# EAGLE design final manual (EAGLE 8.0.1)
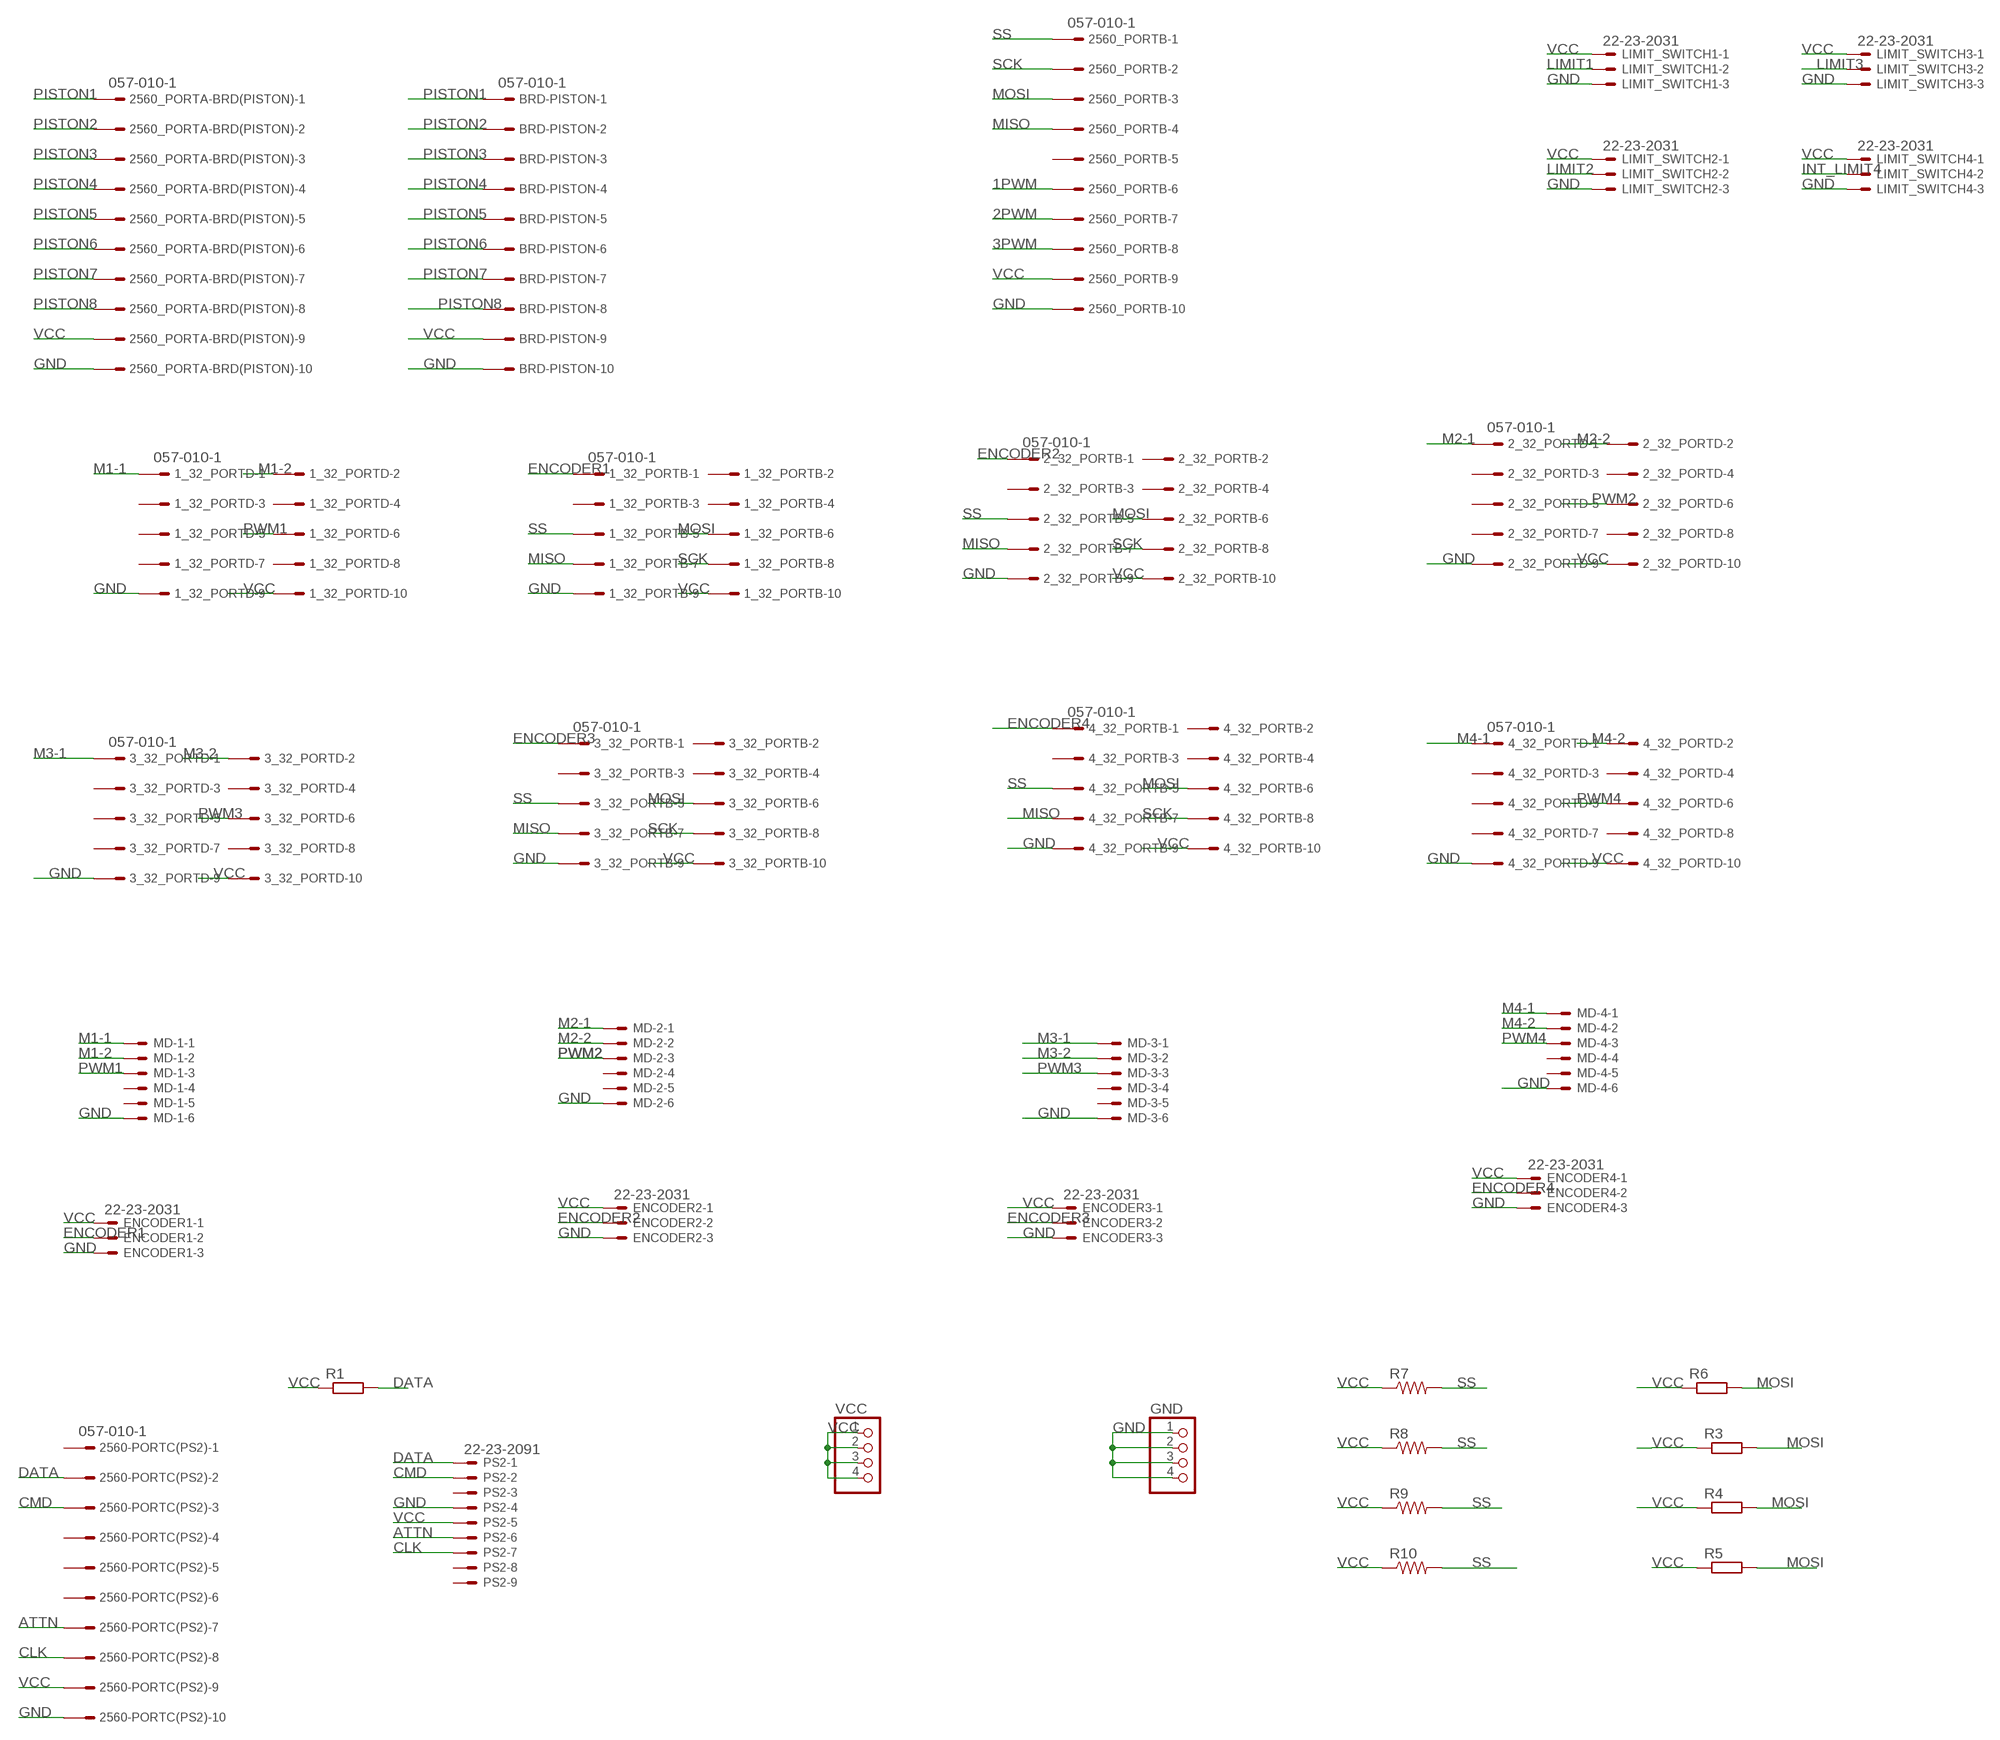
[diagram p0: schematic, sheet 1, part 1 of 2]
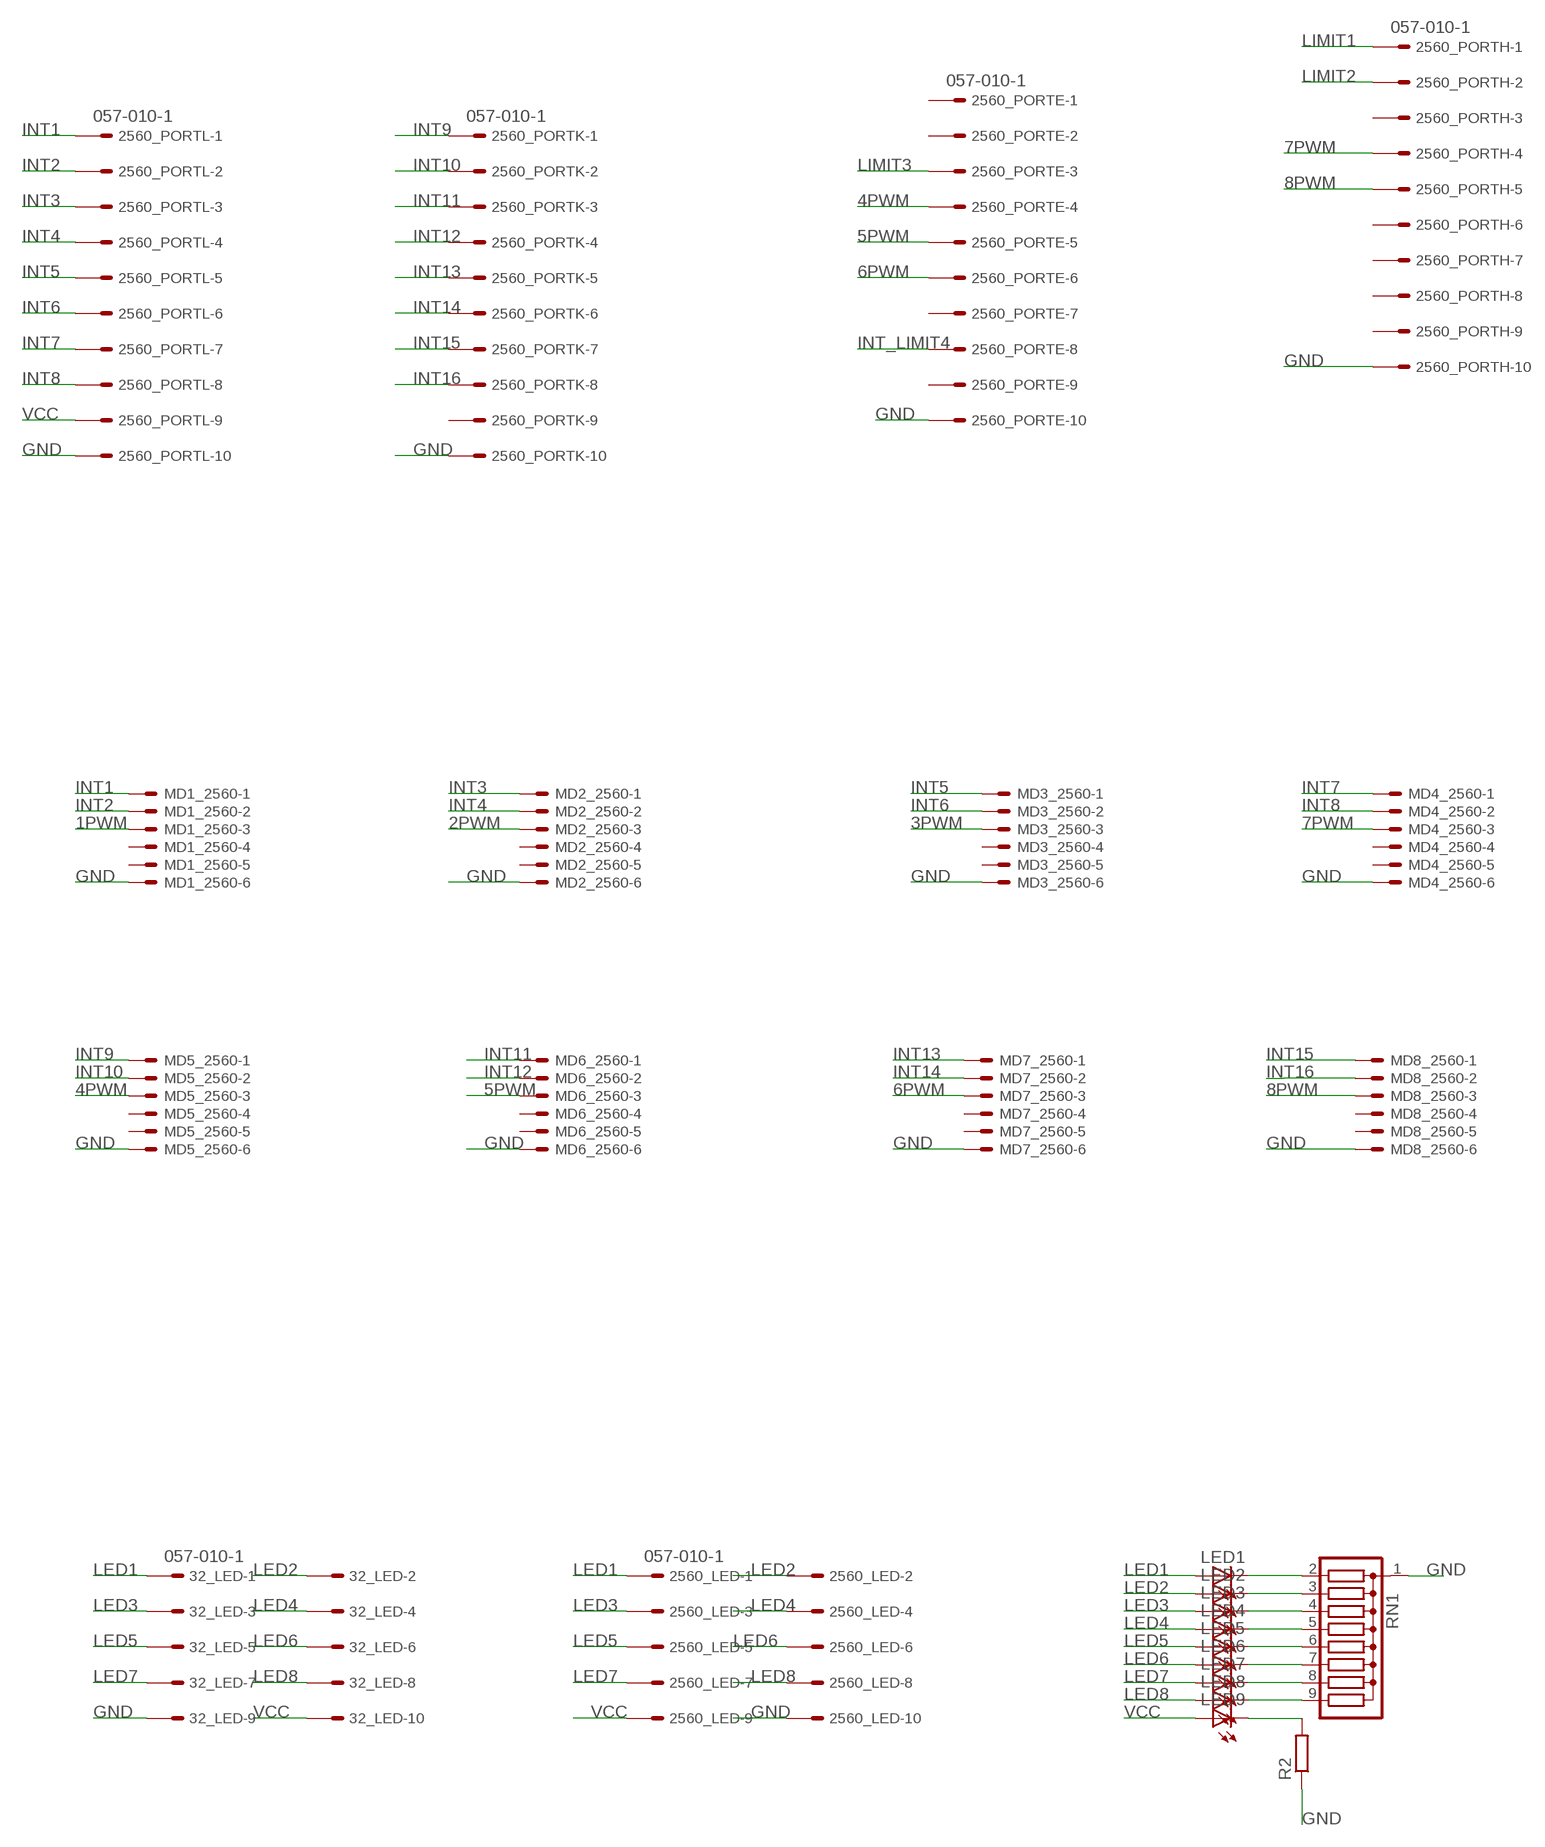
[diagram p1: schematic, sheet 1, part 2 of 2]

## Parts
1_32_PORTB  057-010-1  [057-010-1]
1_32_PORTD  057-010-1  [057-010-1]
2_32_PORTB  057-010-1  [057-010-1]
2_32_PORTD  057-010-1  [057-010-1]
3_32_PORTB  057-010-1  [057-010-1]
3_32_PORTD  057-010-1  [057-010-1]
4_32_PORTB  057-010-1  [057-010-1]
4_32_PORTD  057-010-1  [057-010-1]
32_LED  057-010-1  [057-010-1]
2560-PORTC(PS2)  057-010-1  [057-010-1]
2560_LED  057-010-1  [057-010-1]
2560_PORTA-BRD(PISTON)  057-010-1  [057-010-1]
2560_PORTB  057-010-1  [057-010-1]
2560_PORTE  057-010-1  [057-010-1]
2560_PORTH  057-010-1  [057-010-1]
2560_PORTK  057-010-1  [057-010-1]
2560_PORTL  057-010-1  [057-010-1]
BRD-PISTON  057-010-1  [057-010-1]
ENCODER1  22-23-2031  [22-23-2031]
ENCODER2  22-23-2031  [22-23-2031]
ENCODER3  22-23-2031  [22-23-2031]
ENCODER4  22-23-2031  [22-23-2031]
GND  PINHD-1X4  [1X04]
LED1  LED3MM  [LED3MM]
LED2  LED3MM  [LED3MM]
LED3  LED3MM  [LED3MM]
LED4  LED3MM  [LED3MM]
LED5  LED3MM  [LED3MM]
LED6  LED3MM  [LED3MM]
LED7  LED3MM  [LED3MM]
LED8  LED3MM  [LED3MM]
LED9  LED3MM  [LED3MM]
LIMIT_SWITCH1  22-23-2031  [22-23-2031]
LIMIT_SWITCH2  22-23-2031  [22-23-2031]
LIMIT_SWITCH3  22-23-2031  [22-23-2031]
LIMIT_SWITCH4  22-23-2031  [22-23-2031]
MD1_2560  22-23-2061  [22-23-2061]
MD2_2560  22-23-2061  [22-23-2061]
MD3_2560  22-23-2061  [22-23-2061]
MD4_2560  22-23-2061  [22-23-2061]
MD5_2560  22-23-2061  [22-23-2061]
MD6_2560  22-23-2061  [22-23-2061]
MD7_2560  22-23-2061  [22-23-2061]
MD8_2560  22-23-2061  [22-23-2061]
MD-1  22-23-2061  [22-23-2061]
MD-2  22-23-2061  [22-23-2061]
MD-3  22-23-2061  [22-23-2061]
MD-4  22-23-2061  [22-23-2061]
PS2  22-23-2091  [22-23-2091]
R1  R-EU_0204/7  [0204/7]
R2  R-EU_0204/7  [0204/7]
R3  R-EU_0204/7  [0204/7]
R4  R-EU_0204/7  [0204/7]
R5  R-EU_0204/7  [0204/7]
R6  R-EU_0204/7  [0204/7]
R7  R-US_0204/7  [0204/7]
R8  R-US_0204/7  [0204/7]
R9  R-US_0204/7  [0204/7]
R10  R-US_0204/7  [0204/7]
RN1  G08R  [SIL9]
VCC  PINHD-1X4  [1X04]

## Nets
1PWM: 2560_PORTB.6 MD1_2560.3
2PWM: 2560_PORTB.7 MD2_2560.3
3PWM: 2560_PORTB.8 MD3_2560.3
4PWM: 2560_PORTE.4 MD5_2560.3
5PWM: 2560_PORTE.5 MD6_2560.3
6PWM: 2560_PORTE.6 MD7_2560.3
7PWM: 2560_PORTH.4 MD4_2560.3
8PWM: 2560_PORTH.5 MD8_2560.3
ATTN: 2560-PORTC(PS2).7 PS2.6
CLK: 2560-PORTC(PS2).8 PS2.7
CMD: 2560-PORTC(PS2).3 PS2.2
DATA: 2560-PORTC(PS2).2 PS2.1 R1.2
ENCODER1: 1_32_PORTB.1 ENCODER1.2
ENCODER2: 2_32_PORTB.1 ENCODER2.2
ENCODER3: 3_32_PORTB.1 ENCODER3.2
ENCODER4: 4_32_PORTB.1 ENCODER4.2
GND: 1_32_PORTB.9 1_32_PORTD.9 2_32_PORTB.9 2_32_PORTD.9 3_32_PORTB.9 3_32_PORTD.9 4_32_PORTB.9 4_32_PORTD.9 32_LED.9 2560-PORTC(PS2).10 2560_LED.10 2560_PORTA-BRD(PISTON).10 2560_PORTB.10 2560_PORTE.10 2560_PORTH.10 2560_PORTK.10 2560_PORTL.10 BRD-PISTON.10 ENCODER1.3 ENCODER2.3 ENCODER3.3 ENCODER4.3 GND.1 GND.2 GND.3 GND.4 LIMIT_SWITCH1.3 LIMIT_SWITCH2.3 LIMIT_SWITCH3.3 LIMIT_SWITCH4.3 MD1_2560.6 MD2_2560.6 MD3_2560.6 MD4_2560.6 MD5_2560.6 MD6_2560.6 MD7_2560.6 MD8_2560.6 MD-1.6 MD-2.6 MD-3.6 MD-4.6 PS2.4 R2.1 RN1.1
INT1: 2560_PORTL.1 MD1_2560.1
INT2: 2560_PORTL.2 MD1_2560.2
INT3: 2560_PORTL.3 MD2_2560.1
INT4: 2560_PORTL.4 MD2_2560.2
INT5: 2560_PORTL.5 MD3_2560.1
INT6: 2560_PORTL.6 MD3_2560.2
INT7: 2560_PORTL.7 MD4_2560.1
INT8: 2560_PORTL.8 MD4_2560.2
INT9: 2560_PORTK.1 MD5_2560.1
INT10: 2560_PORTK.2 MD5_2560.2
INT11: 2560_PORTK.3 MD6_2560.1
INT12: 2560_PORTK.4 MD6_2560.2
INT13: 2560_PORTK.5 MD7_2560.1
INT14: 2560_PORTK.6 MD7_2560.2
INT15: 2560_PORTK.7 MD8_2560.1
INT16: 2560_PORTK.8 MD8_2560.2
INT_LIMIT4: 2560_PORTE.8 LIMIT_SWITCH4.2
LED1: 32_LED.1 2560_LED.1 LED1.A
LED2: 32_LED.2 2560_LED.2 LED2.A
LED3: 32_LED.3 2560_LED.3 LED3.A
LED4: 32_LED.4 2560_LED.4 LED4.A
LED5: 32_LED.5 2560_LED.5 LED5.A
LED6: 32_LED.6 2560_LED.6 LED6.A
LED7: 32_LED.7 2560_LED.7 LED7.A
LED8: 32_LED.8 2560_LED.8 LED8.A
LIMIT1: 2560_PORTH.1 LIMIT_SWITCH1.2
LIMIT2: 2560_PORTH.2 LIMIT_SWITCH2.2
LIMIT3: 2560_PORTE.3 LIMIT_SWITCH3.2
M1-1: 1_32_PORTD.1 MD-1.1
M1-2: 1_32_PORTD.2 MD-1.2
M2-1: 2_32_PORTD.1 MD-2.1
M2-2: 2_32_PORTD.2 MD-2.2
M3-1: 3_32_PORTD.1 MD-3.1
M3-2: 3_32_PORTD.2 MD-3.2
M4-1: 4_32_PORTD.1 MD-4.1
M4-2: 4_32_PORTD.2 MD-4.2
MISO: 1_32_PORTB.7 2_32_PORTB.7 3_32_PORTB.7 4_32_PORTB.7 2560_PORTB.4
MOSI: 1_32_PORTB.6 2_32_PORTB.6 3_32_PORTB.6 4_32_PORTB.6 2560_PORTB.3 R3.2 R4.2 R5.2 R6.2
N$1: LED1.K(C) RN1.2
N$2: LED2.K(C) RN1.3
N$3: LED3.K(C) RN1.4
N$4: LED4.K(C) RN1.5
N$5: LED5.K(C) RN1.6
N$6: LED6.K(C) RN1.7
N$7: LED7.K(C) RN1.8
N$8: LED8.K(C) RN1.9
N$10: LED9.K(C) R2.2
PISTON1: 2560_PORTA-BRD(PISTON).1 BRD-PISTON.1
PISTON2: 2560_PORTA-BRD(PISTON).2 BRD-PISTON.2
PISTON3: 2560_PORTA-BRD(PISTON).3 BRD-PISTON.3
PISTON4: 2560_PORTA-BRD(PISTON).4 BRD-PISTON.4
PISTON5: 2560_PORTA-BRD(PISTON).5 BRD-PISTON.5
PISTON6: 2560_PORTA-BRD(PISTON).6 BRD-PISTON.6
PISTON7: 2560_PORTA-BRD(PISTON).7 BRD-PISTON.7
PISTON8: 2560_PORTA-BRD(PISTON).8 BRD-PISTON.8
PWM1: 1_32_PORTD.6 MD-1.3
PWM2: 2_32_PORTD.6 MD-2.3
PWM3: 3_32_PORTD.6 MD-3.3
PWM4: 4_32_PORTD.6 MD-4.3
SCK: 1_32_PORTB.8 2_32_PORTB.8 3_32_PORTB.8 4_32_PORTB.8 2560_PORTB.2
SS: 1_32_PORTB.5 2_32_PORTB.5 3_32_PORTB.5 4_32_PORTB.5 2560_PORTB.1 R7.2 R8.2 R9.2 R10.2
VCC: 1_32_PORTB.10 1_32_PORTD.10 2_32_PORTB.10 2_32_PORTD.10 3_32_PORTB.10 3_32_PORTD.10 4_32_PORTB.10 4_32_PORTD.10 32_LED.10 2560-PORTC(PS2).9 2560_LED.9 2560_PORTA-BRD(PISTON).9 2560_PORTB.9 2560_PORTL.9 BRD-PISTON.9 ENCODER1.1 ENCODER2.1 ENCODER3.1 ENCODER4.1 LED9.A LIMIT_SWITCH1.1 LIMIT_SWITCH2.1 LIMIT_SWITCH3.1 LIMIT_SWITCH4.1 PS2.5 R1.1 R3.1 R4.1 R5.1 R6.1 R7.1 R8.1 R9.1 R10.1 VCC.1 VCC.2 VCC.3 VCC.4
Unconnected: 1_32_PORTB.2 1_32_PORTB.3 1_32_PORTB.4 1_32_PORTD.3 1_32_PORTD.4 1_32_PORTD.5 1_32_PORTD.7 1_32_PORTD.8 2_32_PORTB.2 2_32_PORTB.3 2_32_PORTB.4 2_32_PORTD.3 2_32_PORTD.4 2_32_PORTD.5 2_32_PORTD.7 2_32_PORTD.8 3_32_PORTB.2 3_32_PORTB.3 3_32_PORTB.4 3_32_PORTD.3 3_32_PORTD.4 3_32_PORTD.5 3_32_PORTD.7 3_32_PORTD.8 4_32_PORTB.2 4_32_PORTB.3 4_32_PORTB.4 4_32_PORTD.3 4_32_PORTD.4 4_32_PORTD.5 4_32_PORTD.7 4_32_PORTD.8 2560-PORTC(PS2).1 2560-PORTC(PS2).4 2560-PORTC(PS2).5 2560-PORTC(PS2).6 2560_PORTB.5 2560_PORTE.1 2560_PORTE.2 2560_PORTE.7 2560_PORTE.9 2560_PORTH.3 2560_PORTH.6 2560_PORTH.7 2560_PORTH.8 2560_PORTH.9 2560_PORTK.9 MD1_2560.4 MD1_2560.5 MD2_2560.4 MD2_2560.5 MD3_2560.4 MD3_2560.5 MD4_2560.4 MD4_2560.5 MD5_2560.4 MD5_2560.5 MD6_2560.4 MD6_2560.5 MD7_2560.4 MD7_2560.5 MD8_2560.4 MD8_2560.5 MD-1.4 MD-1.5 MD-2.4 MD-2.5 MD-3.4 MD-3.5 MD-4.4 MD-4.5 PS2.3 PS2.8 PS2.9

## Library data of the parts
1_32_PORTB 1_32_PORTD 2_32_PORTB 2_32_PORTD 3_32_PORTB 3_32_PORTD 4_32_PORTB 4_32_PORTD 32_LED 2560-PORTC(PS2) 2560_LED 2560_PORTA-BRD(PISTON) 2560_PORTB 2560_PORTE 2560_PORTH 2560_PORTK 2560_PORTL BRD-PISTON = con-panduit:057-010-: CONNECTOR 10-pin series 057 contact pc board low profile headers; OC_FARNELL: unknown; OC_NEWARK: unknown
ENCODER1-ENCODER4 LIMIT_SWITCH1-LIMIT_SWITCH4 = con-molex:22-23-2031: .100" (2.54mm) Center Header - 3 Pin; MF: MOLEX; MPN: 22-23-2031; OC_FARNELL: 1462950; OC_NEWARK: 30C0862
GND VCC = pinhead:PINHD-1X4: PIN HEADER
LED1-LED9 = led:LED: LED OSRAM: - CHIPLED LG R971, LG N971, LY N971, LG Q971, LY Q971, LO R971, LY R971 LH N974, LH R974 LS Q976, LO Q976, LY Q976 LO Q996 - Hyper CHIPLED LW Q18S LB Q993, LB Q99A, LB R99A - SideLED LS A670, LO A670, LY A670, LG A670, LP A670 LB A673, LV A673, LT A673, LW A673 LH A674 LY A675 LS A676, LA A676, LO A676, LY A676, LW A676 LS A679, LY A679, LG A679 - Hyper Micro SIDELED® LS Y876, LA Y876, LO Y876, LY Y876 LT Y87S - SmartLED LW L88C, LW L88S LB L89C, LB L89S, LG L890 LS L89K, LO L89K, LY L89K LS L896, LA L896, LO L896, LY L896 - TOPLED LS T670, LO T670, LY T670, LG T670, LP T670 LSG T670, LSP T670, LSY T670, LOP T670, LYG T670 LG T671, LOG T671, LSG T671 LB T673, LV T673, LT T673, LW T673 LH T674 LS T676, LA T676, LO T676, LY T676, LB T676, LH T676, LSB T676, LW T676 LB T67C, LV T67C, LT T67C, LS T67K, LO T67K, LY T67K, LW E67C LS E67B, LA E67B, LO E67B, LY E67B, LB E67C, LV E67C, LT E67C LW T67C LS T679, LY T679, LG T679 LS T770, LO T770, LY T770, LG T770, LP T770 LB T773, LV T773, LT T773, LW T773 LH T774 LS E675, LA E675, LY E675, LS T675 LS T776, LA T776, LO T776, LY T776, LB T776 LHGB T686 LT T68C, LB T68C - Hyper Mini TOPLED® LB M676 - Mini TOPLED Santana® LG M470 LS M47K, LO M47K, LY M47K Source: http://www.osram.convergy.de LUXEON: - LUMILED® LXK2-PW12-R00, LXK2-PW12-S00, LXK2-PW14-U00, LXK2-PW14-V00 LXK2-PM12-R00, LXK2-PM12-S00, LXK2-PM14-U00 LXK2-PE12-Q00, LXK2-PE12-R00, LXK2-PE12-S00, LXK2-PE14-T00, LXK2-PE14-U00 LXK2-PB12-K00, LXK2-PB12-L00, LXK2-PB12-M00, LXK2-PB14-N00, LXK2-PB14-P00, LXK2-PB14-Q00 LXK2-PR12-L00, LXK2-PR12-M00, LXK2-PR14-Q00, LXK2-PR14-R00 LXK2-PD12-Q00, LXK2-PD12-R00, LXK2-PD12-S00 LXK2-PH12-R00, LXK2-PH12-S00 LXK2-PL12-P00, LXK2-PL12-Q00, LXK2-PL12-R00 Source: www.luxeon.com KINGBRIGHT: KA-3528ASYC Source: www.kingbright.com
MD1_2560 MD2_2560 MD3_2560 MD4_2560 MD5_2560 MD6_2560 MD7_2560 MD8_2560 MD-1-MD-4 = con-molex:22-23-2061: .100" (2.54mm) Center Header - 6 Pin; MF: MOLEX; MPN: 22-23-2061; OC_FARNELL: 1462922; OC_NEWARK: 27C1933
PS2 = con-molex:22-23-2091: .100" (2.54mm) Center Header - 9 Pin; MF: MOLEX; MPN: 22-23-2091; OC_FARNELL: 1756827; OC_NEWARK: 56H0450
R1-R6 = rcl:R-EU_: RESISTOR, European symbol
R7-R10 = rcl:R-US_: RESISTOR, American symbol
RN1 = resistor-sil:G08R: SIL RESISTOR; OC_FARNELL: unknown; OC_NEWARK: unknown

## Board
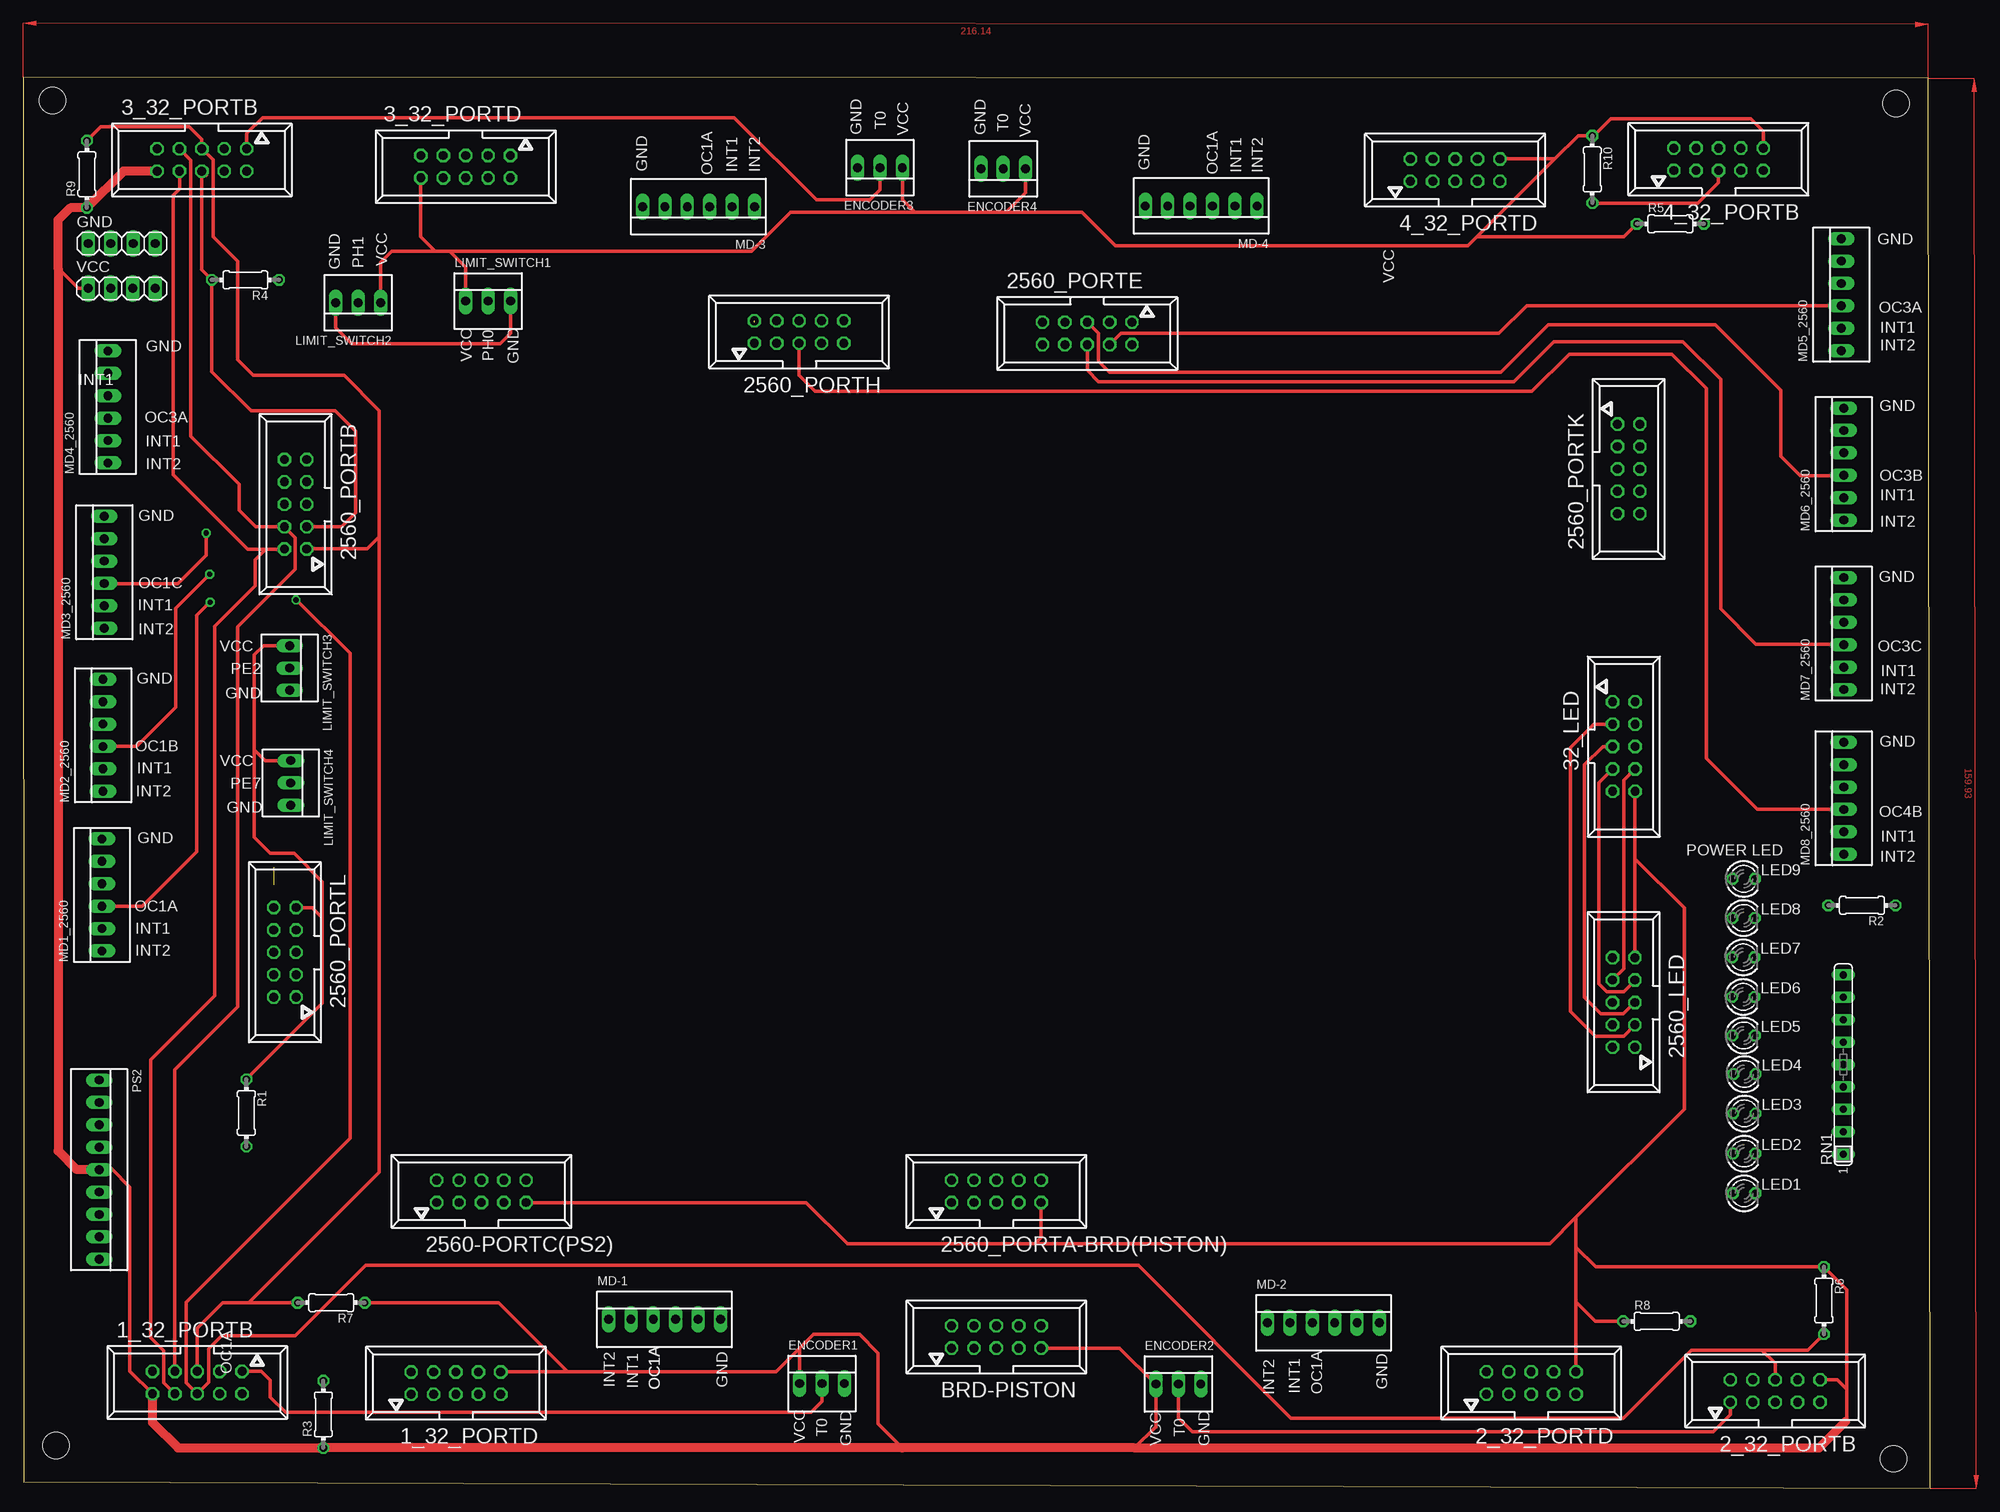
[diagram p2: board, top side]
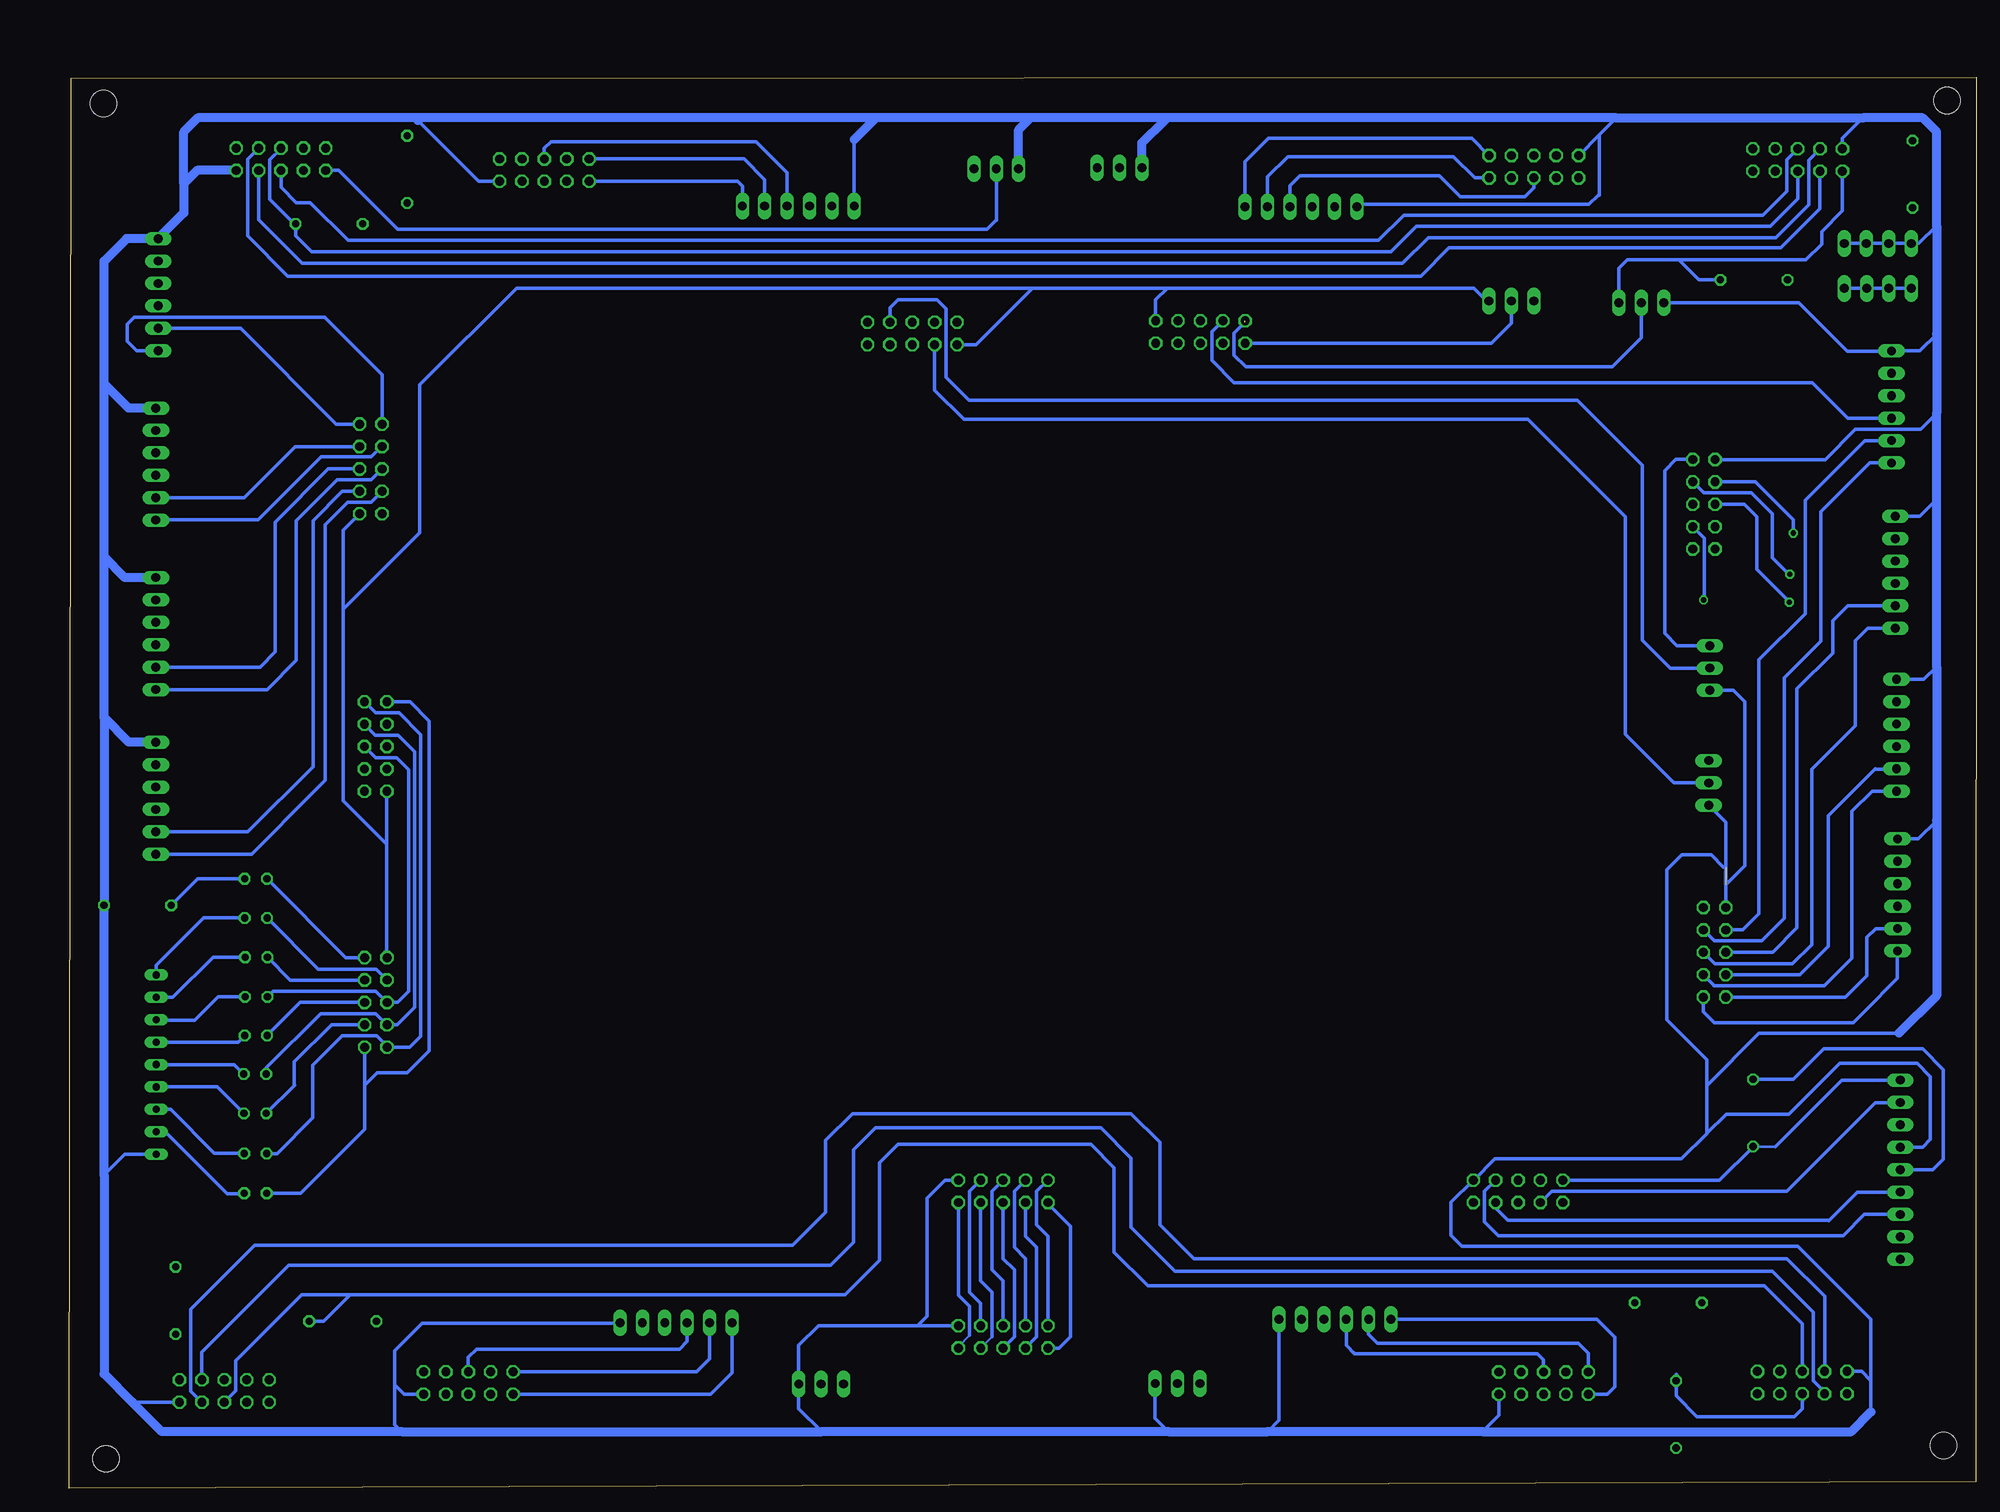
[diagram p3: board, bottom side, seen from below]

Size 216.38 x 160.07 mm. Coordinates in mm from the lower left corner, seen from the top.
Outline: 0.05,0.74 216.38,0 216.14,159.93 0,160.07 0.05,0.74
Copper layers (1*16): Top 0.035mm / dielectric 1.5mm / Bottom 0.035mm
Design rules "default": minimum track width 10mil, minimum drill 24mil, track to track 8mil, track to pad 8mil, pad to pad 8mil, via to via 8mil, smd to smd 8mil, copper to edge 40mil, drill to drill 8mil, minimum pad ring 10mil, minimum via ring 8mil, stop-mask expansion 4mil, vias tented up to drill 0mil, thermal gap 10mil
Holes 3 mm at 212.19,3.37 3.71,4.88 3.34,157.42 212.48,157.08

### Footprints (pad centres in the part's own frame; a part is rotated, then mirrored left to right if it is on the bottom)
057-010-1 = drill 1 octagon: 1 -5.08,-1.27; 2 -5.08,1.27; 3 -2.54,-1.27; 4 -2.54,1.27; 5 0,-1.27; 6 0,1.27; 7 2.54,-1.27; 8 2.54,1.27; 9 5.08,-1.27; 10 5.08,1.27
22-23-2031 = drill 1 long: 1 -2.54,0; 2 0,0; 3 2.54,0
1X04 = drill 1.016 long: 1 -3.81,0; 2 -1.27,0; 3 1.27,0; 4 3.81,0
LED3MM = drill 0.813 octagon: A -1.27,0; K 1.27,0
22-23-2061 = drill 1 long: 1 -6.35,0; 2 -3.81,0; 3 -1.27,0; 4 1.27,0; 5 3.81,0; 6 6.35,0
22-23-2091 = drill 1 long: 1 -10.16,0; 2 -7.62,0; 3 -5.08,0; 4 -2.54,0; 5 0,0; 6 2.54,0; 7 5.08,0; 8 7.62,0; 9 10.16,0
0204/7 = drill 0.813 octagon: 1 -3.81,0; 2 3.81,0
SIL9 = drill 0.813 long: 1 -10.16,0; 2 -7.62,0; 3 -5.08,0; 4 -2.54,0; 5 0,0; 6 2.54,0; 7 5.08,0; 8 7.62,0; 9 10.16,0

### Placement (x,y rotation side)
1_32_PORTB  19.75,12 180 top
1_32_PORTD  49.1,11.94 0 top
2_32_PORTB  198.77,11.05 0 top
2_32_PORTD  171.09,11.95 0 top
3_32_PORTB  20.27,150.67 180 top
3_32_PORTD  50.2,149.91 180 top
4_32_PORTB  192.34,150.75 0 top
4_32_PORTD  162.46,149.52 0 top
32_LED  181.6,84.14 270 top
2560-PORTC(PS2)  51.99,33.69 0 top
2560_LED  181.58,55.12 90 top
2560_PORTA-BRD(PISTON)  110.41,33.69 0 top
2560_PORTB  30.9,111.62 90 top
2560_PORTE  120.72,131 180 top
2560_PORTH  88.03,131.16 0 top
2560_PORTK  182.15,115.63 270 top
2560_PORTL  29.7,60.8 90 top
BRD-PISTON  110.41,17.18 0 top
ENCODER1  90.62,11.89 0 top
ENCODER2  131.06,11.84 0 top
ENCODER3  97.2,149.8 180 top
ENCODER4  111.19,149.67 180 top
GND  11.19,141.2 0 top
LED1  195.24,33.47 0 top
LED2  195.25,37.98 0 top
LED3  195.28,42.53 0 top
LED4  195.29,47 0 top
LED5  195.19,51.37 0 top
LED6  195.15,55.75 0 top
LED7  195.14,60.24 0 top
LED8  195.19,64.7 0 top
LED9  195.2,69.14 0 top
LIMIT_SWITCH1  52.75,134.67 0 top
LIMIT_SWITCH2  38,134.48 180 top
LIMIT_SWITCH3  30.23,93.05 270 top
LIMIT_SWITCH4  30.36,80.01 270 top
MD1_2560  8.94,67.31 90 top
MD2_2560  9.06,85.42 90 top
MD3_2560  9.2,103.91 90 top
MD4_2560  9.61,122.66 90 top
MD5_2560  206.27,135.4 90 top
MD6_2560  206.54,116.18 90 top
MD7_2560  206.54,96.96 90 top
MD8_2560  206.54,78.28 90 top
MD-1  72.76,19.18 0 top
MD-2  147.53,18.78 0 top
MD-3  76.61,145.37 180 top
MD-4  133.65,145.46 180 top
PS2  8.62,36.15 270 top
R1  25.32,42.58 270 top
R2  208.61,66.13 180 top
R3  34.06,8.39 90 top
R4  25.22,137.07 180 top
R5  186.88,143.43 0 top
R6  204.3,21.31 270 top
R7  34.95,21.06 180 top
R8  185.33,18.95 0 top
R9  7.23,149.06 90 top
R10  178.02,149.61 270 top
RN1  206.5,48.07 90 top
VCC  11.18,136.1 0 top

### Tracks (layer width: path | path; a pad name or v marks a point on that pad's centre or on a via)
1PWM  (via drill 0.6)
  Top 0.305: MD1_2560.3 8.96,66.02
  Top 0.406: MD1_2560.3 13.45,66.04 | 13.45,66.04 13.47,66.02 | 13.45,66.04 13.49,66.04 19.68,72.23 19.68,85.05 | v21.21,100.51 21.18,100.51 19.68,99.01 19.68,85.05 | 19.68,85.05 19.68,84.6
  Bottom 0.406: 2560_PORTB.6 26.33,111.62 24.89,110.18 24.89,104.23 21.27,100.61 21.27,100.57 v21.21,100.51
2PWM  (via drill 0.6)
  Top 0.305: MD2_2560.3
  Top 0.406: MD2_2560.3 12.88,84.15 17.32,88.59 17.32,99.82 21.16,103.66 v21.16,103.69
  Bottom 0.406: 2560_PORTB.7 30.94,112.93 25.55,112.93 23.15,110.53 23.15,105.56 21.17,103.58 v21.17,103.68 v21.16,103.69
3PWM  (via drill 0.6)
  Top 0.406: v20.76,108.35 20.76,105.84 17.51,102.59 9.25,102.59 MD3_2560.3
  Bottom 0.406: 2560_PORTB.8 25.05,114.16 20.77,109.88 20.77,108.46 20.81,108.42 20.81,108.4 v20.76,108.35
4PWM
  Top 0.406: 2560_PORTE.4 124.53,131 167.44,131 170.57,134.13 MD5_2560.3
5PWM
  Top 0.406: MD6_2560.3 206.48,114.85 201.63,114.85 199.4,117.08 199.4,124.57 191.99,131.98 173.04,131.98 167.63,126.57 123.25,126.57 121.99,127.83 121.99,131 2560_PORTE.5
6PWM
  Top 0.406: 169.71,126.11 169.51,125.91 | 169.71,126.11 173.68,130.08 188.31,130.08 192.58,125.81 192.58,99.77 196.6,95.75 206.48,95.75 MD7_2560.3 | 169.71,126.11 169.14,125.54 122,125.54 120.72,126.82 2560_PORTE.6
7PWM
  Bottom 0.406: 2560_PORTH.4 86.74,131.18 86.74,127.94 84.21,125.41 18.59,125.41 14.57,121.39 MD4_2560.3
8PWM
  Top 0.406: 2560_PORTH.5 88.03,126.27 89.86,124.44 171.18,124.44 175.4,128.66 187.05,128.66 190.94,124.77 190.94,82.84 196.74,77.04 206.51,77.04 MD8_2560.3
ATTN
  Bottom 0.406: PS2.6 12.7,33.61 13.5,33.61 16.57,30.54 | 16.57,30.54 16.75,30.36 | 2560-PORTC(PS2).7 54.53,31.78 53.14,30.39 16.72,30.39 16.57,30.54
CLK
  Bottom 0.406: PS2.7 12.7,31.07 15.1,28.67 54.25,28.67 55.8,30.22 55.8,33.69 2560-PORTC(PS2).8
CMD
  Bottom 0.406: PS2.2 8.64,43.75 11.45,43.75 21.51,33.69 48.18,33.69 2560-PORTC(PS2).3
DATA
  Bottom 0.305: R1.2 22.78,38.77
  Bottom 0.406: PS2.1 15.24,46.31 22.78,38.77 | 2560-PORTC(PS2).2 29.13,34.96 R1.2
ENCODER1
  Top 0.305: 90.66,11.85 ENCODER1.2
  Top 0.406: 1_32_PORTB.1 27,13.27 28.03,12.24 28.03,10.35 29.76,8.62 89.37,8.62 90.62,9.87 ENCODER1.2
ENCODER2
  Top 0.305: ENCODER2.2
  Top 0.406: 2_32_PORTB.1 193.69,8.37 191.73,6.41 134.42,6.41 134.41,6.42 132.65,6.42 131.06,8.01 ENCODER2.2
ENCODER3
  Top 0.305: 97.16,149.84 ENCODER3.2
  Top 0.406: 3_32_PORTB.1 25.35,153.69 27.15,155.49 80.68,155.49 90.01,146.16 95.98,146.16 96.01,146.13 97.2,147.32 ENCODER3.2
ENCODER4
  Bottom 0.406: ENCODER4.2 111.19,143.85 111.21,143.85 111.85,143.21 | 4_32_PORTB.1 185.77,149.48 179.13,142.84 112.22,142.84 | 111.85,143.21 112.22,142.84 | 112.22,142.84 111.85,143.21
GND  (1 unrouted)
  Top 0.406: LIMIT_SWITCH1.3 55.29,131.02 54.1,129.83 37.28,129.83 35.46,131.65 LIMIT_SWITCH2.3
  Bottom 0.305: 206.33,141.75 MD5_2560.6 206.25,141.77 | 79.14,19.15 MD-1.6 | 133.62,11.82 ENCODER2.3 | 92.12,155.15 92.31,155.15 | 30.59,40.3 30.55,40.27
  Bottom 0.406: 42.78,153.52 3_32_PORTD.9 | 42.78,153.52 40.86,155.44 | 206.32,141.74 206.33,141.75 | 32_LED.9 180.33,73.23 | 180.33,73.23 180.33,60.22 2560_LED.10 | 180.33,73.23 180.51,73.23 185.27,77.99 185.27,99.73 | 185.27,99.73 185.27,108.7 2560_PORTK.10 | 185.27,99.73 176.59,108.41 176.59,125.18 165.62,136.15 107.06,136.15 | 4_32_PORTD.9 169.91,148.25 176.79,155.13 176.81,155.15 | MD-4.6 127.3,152.97 | 42.78,153.52 42.78,146.7 42.91,146.7 43.95,145.65 69.98,145.65 MD-3.6 | PS2.4 6.1,38.69 5.2,39.59 5.2,46.69 6.71,48.2 15.5,48.2 21.26,42.44 28.38,42.44 30.55,40.27 | 30.59,45.69 30.59,48.64 35.1,53.15 35.1,70.16 33.4,71.86 30.09,71.86 28.7,70.47 28.43,70.47 | 30.59,45.69 30.59,40.3 30.59,40.23 33.44,37.38 54.61,37.38 57.03,34.96 2560-PORTC(PS2).10 59.59,32.44 59.59,28.73 58.35,27.49 20.24,27.49 11.95,19.2 11.95,12.21 | 1_32_PORTB.9 13.01,13.27 11.95,12.21 | 11.95,8.68 11.95,12.21 | 2_32_PORTD.9 178.37,10.68 179.47,11.78 | 179.47,11.78 179.47,15.59 176.31,18.75 153.91,18.75 MD-2.6 | 2560_PORTA-BRD(PISTON).10 116.99,34.96 119.05,32.9 119.05,19.51 120.11,18.45 | BRD-PISTON.10 120.11,18.45 | 120.11,18.45 131.38,18.45 133.6,16.23 ENCODER2.3 133.6,9.06 130.98,6.44 | 2560_PORTH.10 93.11,134.82 91.78,136.15 | 28.43,68.48 2560_PORTL.10 | 28.43,68.48 28.43,75.54 LIMIT_SWITCH4.3 | LIMIT_SWITCH3.3 27.57,90.51 26.29,89.23 26.29,70.62 28.43,68.48 | 2560_PORTB.10 17.14,116.7 13.72,120.12 6.31,120.12 4.51,121.92 | 107.06,136.15 91.78,136.15 | 2560_PORTE.10 113.48,129.73 107.06,136.15 | GND.4 GND.3 GND.2 GND.1 6.52,141.2 4.51,143.21 | LIMIT_SWITCH1.3 55.51,134.67 56.99,136.15 91.78,136.15 | LIMIT_SWITCH2.3 20.15,134.48 14.66,128.99 9.63,128.99 MD4_2560.6 6.43,129.01 4.51,130.93
  Bottom 0.406: 8.77,51.63 24.65,51.63 30.59,45.69 | RN1.1 210.08,37.91 212.42,35.57 | 2_32_PORTB.9 209.19,9.78 | 80.39,6.44 79.11,7.72 MD-1.6 | 178.67,6.44 179.47,7.24 179.47,11.78 | MD3_2560.6 6.42,110.26 4.51,112.17 | MD1_2560.6 6.6,73.66 4.51,75.75 | MD2_2560.6 5.95,91.77 4.51,93.21 | 3_32_PORTB.9 15.19,153.13 12.88,155.44 | 1_32_PORTD.9 54.18,8.28 56.02,6.44 | 91.67,6.44 93.16,7.93 ENCODER1.3
  Bottom 1.016: 91.83,155.44 40.86,155.44 12.88,155.44 6.1,155.44 4.51,153.85 4.51,143.21 4.51,130.93 4.51,121.92 4.51,112.17 4.51,93.21 4.51,75.75 4.51,55.89 8.77,51.63 | 91.83,155.44 92.12,155.15 94.66,152.61 ENCODER3.3 | 91.83,155.44 107.3,155.44 | ENCODER4.3 108.65,154.09 107.3,155.44 | 107.3,155.44 124.83,155.44 | 127.3,152.97 124.83,155.44 | 124.83,155.44 176.48,155.44 | 176.48,155.44 176.79,155.13 | 203.36,147.97 203.36,153.85 201.77,155.44 176.48,155.44 | 203.36,147.97 203.36,144.66 206.25,141.77 | 4_32_PORTB.9 201.85,149.48 203.36,147.97 | 212.42,105.67 212.42,125.32 | 212.42,87.46 212.42,105.67 | 212.42,87.46 R2.1 212.42,35.57 212.42,13 209.19,9.78 205.86,6.44 178.67,6.44 130.98,6.44 91.67,6.44 80.39,6.44 56.02,6.44 14.19,6.44 11.95,8.68 | 212.42,125.32 212.42,139.2 209.87,141.75 MD5_2560.6 | MD6_2560.6 209.63,122.53 212.42,125.32 | MD7_2560.6 210.06,103.31 212.42,105.67 | MD8_2560.6 209.59,84.63 212.42,87.46
INT1
  Bottom 0.305: 8.96,60.94 MD1_2560.1
  Bottom 0.406: MD1_2560.1 8.94,57.85 12.65,54.14 13.98,52.81 29.74,52.81 30.97,54.04 2560_PORTL.1
INT2
  Bottom 0.305: 8.96,63.48 MD1_2560.2
  Bottom 0.406: MD1_2560.2 11.41,63.5 12.41,62.5 12.41,58.16 14.85,55.72 2560_PORTL.2
INT3
  Bottom 0.305: 2560_PORTL.3 30.97,58.22
  Bottom 0.406: MD2_2560.1 11.82,79.07 14.11,76.78 14.11,60.15 17.24,57.02 29.77,57.02 29.77,57.06 2560_PORTL.3
INT4
  Bottom 0.305: MD2_2560.2
  Bottom 0.406: 11.5,81.59 15.45,77.64 16.8,76.29 16.8,61.51 20.05,58.26 2560_PORTL.4 | 11.5,81.59 11.49,81.6 | 11.5,81.59 9.08,81.59 MD2_2560.2
INT5
  Bottom 0.305: 2560_PORTL.5
  Bottom 0.406: 11.23,97.56 MD3_2560.1 12.31,97.56 13.74,96.13 13.74,86.49 17.55,82.67 | 2560_PORTL.5 29.67,59.5 20.85,59.5 18.69,61.66 18.69,81.54 17.55,82.67 | 17.55,82.67 17.89,82.34
INT6
  Bottom 0.305: MD3_2560.2
  Bottom 0.406: 2560_PORTL.6 23.11,60.8 20.34,63.57 20.34,90.67 16.26,94.75 16.26,98.42 14.58,100.1 MD3_2560.2
INT7
  Bottom 0.305: 2560_PORTL.7 | 9.63,116.33 MD4_2560.1
  Bottom 0.406: MD4_2560.1 11.5,116.31 12.09,116.31 17.65,110.75 17.65,96.09 21.78,91.96 21.78,64.69 24.36,62.11 29.71,62.11 29.73,62.09 29.73,62.1 2560_PORTL.7
INT8
  Bottom 0.305: 9.65,118.81 MD4_2560.2
  Bottom 0.406: MD4_2560.2 12.66,118.85 19.35,112.16 19.43,112.08 19.43,99.19 24.66,93.96 24.66,65.18 26.5,63.34 2560_PORTL.8
INT9
  Bottom 0.406: MD5_2560.1 208.71,129.05 209.8,130.14 209.8,132.02 209.78,132.02 208.98,132.82 194.09,132.82 187.36,132.82 180.88,126.34 2560_PORTK.1
INT10
  Bottom 0.406: MD5_2560.2 196.95,131.59 196.93,131.57 186.07,120.71 2560_PORTK.2
INT11
  Bottom 0.406: 2560_PORTK.3 180.91,118.17 182.09,116.99 185.36,116.99 187.78,116.99 194.91,109.86 206.51,109.86 MD6_2560.1
INT12
  Bottom 0.406: 2560_PORTK.4 186.24,118.17 190.72,118.17 196.52,112.37 MD6_2560.2
INT13
  Bottom 0.305: 2560_PORTK.5 180.88,115.6
  Bottom 0.406: 2560_PORTK.5 182.13,114.38 185.09,114.38 185.99,114.38 189.5,110.87 | MD7_2560.1 195.9,90.61 193.91,90.61 190.61,93.91 190.61,109.76 189.5,110.87 | 189.5,110.87 189.78,110.59
INT14
  Bottom 0.305: 185.49,115.61 185.49,115.63 | 206.51,93.18 MD7_2560.2
  Bottom 0.406: 2560_PORTK.6 185.49,115.63 186.96,115.63 192.98,109.61 192.98,94.88 194.71,93.15 194.91,93.15 MD7_2560.2
INT15
  Bottom 0.406: 2560_PORTK.7 182.1,111.87 184.66,111.87 184.75,111.87 187.31,109.31 187.31,80.31 188.69,78.93 195.69,71.93 MD8_2560.1
INT16
  Bottom 0.305: MD8_2560.2
  Bottom 0.406: 2560_PORTK.8 184.74,113.09 185.39,113.09 188.71,109.77 188.71,81.85 196.09,74.47 196.59,74.47 MD8_2560.2
INT_LIMIT4
  Bottom 0.406: 2560_PORTE.8 118.18,124.57 114.86,121.25 50.86,121.25 39.84,110.23 39.84,85.55 34.31,80.02 LIMIT_SWITCH4.2
LED1
  Bottom 0.406: 182.85,45.72 182.85,40.75 190.13,33.47 LED1.A | 182.85,45.72 2560_LED.1 | 182.85,45.72 181.44,47.13 178,47.13 175.52,49.61 175.52,87.03 177.71,89.22 32_LED.1
LED2
  Bottom 0.406: LED2.A 192.8,37.98 188.76,42.02 188.76,47.99 185.41,51.34 181.48,51.34 180.31,50.17 2560_LED.2 177.73,50.04 176.47,51.3 176.47,85.5 178.94,87.97 181.62,87.97 32_LED.2
LED3
  Top 0.305: 32_LED.3
  Top 0.406: 2560_LED.3 181.58,51.31 178.35,51.31 175.53,54.13 175.53,84.01 178.2,86.68 | 178.2,86.68 32_LED.3 | 178.2,86.68 178.19,86.67
  Bottom 0.305: 190.79,45.75 190.82,45.78
  Bottom 0.406: 2560_LED.3 186.61,52.58 190.82,48.37 190.82,45.78 | LED3.A 190.79,45.75
LED4
  Bottom 0.305: 187.84,53.87 187.82,53.85
  Bottom 0.406: LED4.A 194.02,47.69 187.86,53.85 187.82,53.85 181.58,53.85 2560_LED.4 179.17,52.58 177.18,54.57 177.18,83.56 179.06,85.44 181.63,85.44 32_LED.4
LED5
  Top 0.406: 32_LED.5 179.22,84.14 177.13,82.05 177.13,55.7 178.98,53.85 181.55,53.85 182.82,55.12 2560_LED.5
  Bottom 0.406: 2560_LED.5 190.17,55.12 LED5.A
LED6
  Bottom 0.406: 2560_LED.6 | LED6.A 193.24,56.39 181.59,56.39 2560_LED.6 | 32_LED.6 182.84,84.14 181.59,82.89 179.24,82.89 177.87,81.52 177.87,56.38 179.13,55.12 2560_LED.6 | 2560_LED.6
LED7
  Top 0.406: 2560_LED.7 182.85,57.58 181.59,56.32 179.67,56.32 178.74,57.25 178.74,80.01 32_LED.7
  Bottom 0.406: 2560_LED.7 191.29,57.66 LED7.A
LED8
  Top 0.406: 2560_LED.8 180.31,57.69 181.58,58.96 181.58,80.31 32_LED.8
  Bottom 0.305: 2560_LED.8
  Bottom 0.406: LED8.A 188.13,58.91 181.55,58.91 2560_LED.8
LIMIT1
  Bottom 0.305: LIMIT_SWITCH1.2
  Bottom 0.406: LIMIT_SWITCH1.2 52.75,132.15 55.01,129.89 2560_PORTH.1
LIMIT2  (1 unrouted)
  Bottom 0.406: LIMIT_SWITCH2.2 38,130.5 41.28,127.22 82.87,127.22 84.2,128.55 84.2,131.04 82.95,132.29
LIMIT3
  Bottom 0.406: 2560_PORTE.3 123.26,133.89 122.34,134.81 117.93,134.81 116.91,133.79 116.91,126.01 114.3,123.4 45.24,123.4 37.88,116.04 37.88,96.19 35.31,93.62 | 35.31,93.62 34.74,93.05 | LIMIT_SWITCH3.2 34.74,93.05 | 34.74,93.05 35.31,93.62
M1-1
  Bottom 0.305: MD-1.1
  Bottom 0.406: 1_32_PORTD.1 41.87,10.67 41.02,11.52 41.02,17.16 41.03,17.17 43.03,19.17 MD-1.1
M1-2
  Bottom 0.305: 68.97,19.16 MD-1.2
  Bottom 0.406: MD-1.2 68.95,17.49 67.93,16.47 45.17,16.47 44.02,15.32 1_32_PORTD.2
M2-1
  Bottom 0.305: 141.13,18.73 MD-2.1
  Bottom 0.406: MD-2.1 141.18,13.12 143.62,10.68 2_32_PORTD.1
M2-2
  Bottom 0.305: 144.96,13.45 145.16,13.24 | 165.99,13.24 2_32_PORTD.2
  Bottom 0.406: 2_32_PORTD.2 145.18,13.22 144.96,13.45 143.72,14.68 MD-2.2
M3-1
  Bottom 0.305: MD-3.1
  Bottom 0.406: MD-3.1 82.96,150.49 80.33,153.12 57.22,153.12 3_32_PORTD.1
M3-2
  Bottom 0.406: MD-3.2 80.42,148.75 78.12,151.05 59.31,151.05 56.9,148.64 3_32_PORTD.2
M4-1
  Bottom 0.305: MD-4.1
  Bottom 0.406: MD-4.1 140,147.72 140.53,148.25 4_32_PORTD.1
M4-2
  Bottom 0.305: MD-4.2
  Bottom 0.406: MD-4.2 137.46,148.43 139.82,150.79 4_32_PORTD.2
MISO
  Top 0.406: 3_32_PORTB.7 19,150.67 19,119.36 24.48,113.88 24.48,110.97 26.37,109.08 2560_PORTB.4 30.88,107.83 30.88,104.23 24.36,97.71 24.36,54.62 17.21,47.47 1_32_PORTB.7
  Bottom 0.406: 17.73,151.88 3_32_PORTB.7 19.03,150.64 19.03,145.6 22.75,141.88 62.17,141.88 65.11,138.94 189.95,138.94 194.88,143.87 4_32_PORTB.7 | 2_32_PORTB.7 201.34,9.78 202.56,11 202.56,20.34 195.33,27.57 134.32,27.57 130.55,31.34 130.55,39.46 127.52,42.49 95.89,42.49 92.64,39.24 92.64,29.92 90.06,27.34 | 90.06,27.34 89.41,26.69 | 90.06,27.34 88.77,26.05 21.48,26.05 17.21,21.78 1_32_PORTB.7
MOSI  (via drill 0.6)
  Top 0.406: 2560_PORTB.3 36.13,109.08 37.7,110.65 37.7,119.9 35.37,122.23 25.85,122.23 21.41,126.67 R4.2 20.27,138.21 3_32_PORTB.6 20.74,148.93 | v30.94,100.78 30.94,100.86 37.08,94.72 37.08,39.69 18.49,21.1 18.49,11.99 1_32_PORTB.6 21.04,12.02 21.04,15.82 22.53,17.31 30.84,17.31 37.81,24.28 | 197.26,15.69 189.27,15.69 181.54,7.96 143.85,7.96 126.51,25.3 38.83,25.3 37.81,24.28 | 2_32_PORTB.6 198.77,14.18 197.26,15.69 | 197.26,15.69 202.49,15.69 R6.2 | 37.81,24.28 38.63,25.1
  Bottom 0.406: 2560_PORTB.3 30.88,107.79 30.88,100.84 v30.94,100.78 | 1_32_PORTB.6 19.75,9.05 20.66,8.14 31.71,8.14 34.05,10.48 34.05,12.96 R3.2 | 3_32_PORTB.6 20.27,146.26 23.38,143.15 63.52,143.15 66.41,140.26 188.88,140.26 190.69,142.07 R5.2 190.83,143.43 193.6,146.2 193.6,150.69 192.34,151.95 4_32_PORTB.6
N$1
  Bottom 0.406: RN1.2 205.45,40.45 198.43,33.43 196.55,33.43 LED1.K
N$2
  Bottom 0.406: RN1.3 204.86,42.99 199.89,38.02 196.56,38.02 LED2.K
N$3
  Bottom 0.406: RN1.4 199.55,45.53 LED3.K
N$4
  Bottom 0.406: RN1.5 197.63,48.07 LED4.K
N$5
  Bottom 0.305: LED5.K 196.56,51.47
  Bottom 0.406: RN1.6 197.22,50.61 LED5.K
N$6
  Bottom 0.406: LED6.K 199.49,55.75 202.13,53.11 206.46,53.11 RN1.7
N$7
  Bottom 0.406: RN1.8 204.6,55.69 200.02,60.27 196.44,60.27 LED7.K
N$8
  Bottom 0.406: RN1.9 206.5,59.36 201.13,64.73 196.49,64.73 LED8.K
N$10
  Bottom 0.305: 196.5,69.11 LED9.K
  Bottom 0.406: LED9.K 201.79,69.14 R2.2
PISTON1
  Bottom 0.406: 2560_PORTA-BRD(PISTON).1 105.33,32.26 102.79,29.72 102.79,17.18 104.06,15.91 BRD-PISTON.1
PISTON2
  Bottom 0.406: BRD-PISTON.2 105.33,28.61 106.6,29.88 106.6,33.69 2560_PORTA-BRD(PISTON).2
PISTON3
  Bottom 0.406: BRD-PISTON.3 106.6,17.18 106.6,27.24 | 106.6,27.34 106.6,27.24 | 2560_PORTA-BRD(PISTON).3 107.87,28.61 106.6,27.34 | 106.6,27.24 106.6,27.34
PISTON4
  Bottom 0.406: BRD-PISTON.4 107.87,26.07 109.14,27.34 109.14,33.69 2560_PORTA-BRD(PISTON).4
PISTON5
  Bottom 0.406: 2560_PORTA-BRD(PISTON).5 110.41,26.07 109.14,24.8 109.14,17.18 BRD-PISTON.5
PISTON6
  Bottom 0.406: BRD-PISTON.6 110.41,23.53 111.68,24.8 111.68,33.69 2560_PORTA-BRD(PISTON).6
PISTON7
  Bottom 0.305: BRD-PISTON.7 111.68,17.18
  Bottom 0.406: 2560_PORTA-BRD(PISTON).7 112.95,23.53 111.68,22.26 111.68,17.18
PISTON8
  Bottom 0.406: BRD-PISTON.8 112.95,20.99 114.22,22.26 114.22,33.69 2560_PORTA-BRD(PISTON).8
PWM1
  Bottom 0.406: 1_32_PORTD.6 49.1,14.58 49.81,15.29 70.56,15.29 | 70.56,15.29 70.63,15.36 | MD-1.3 71.49,16.22 70.56,15.29
PWM2
  Bottom 0.406: 2_32_PORTD.6 171.09,14.86 170.15,15.8 147.14,15.8 146.24,16.7 146.24,18.76 MD-2.3
PWM3
  Bottom 0.406: 3_32_PORTD.6 50.2,147.52 51.22,146.5 58.51,146.5 60.89,148.88 76.76,148.88 77.88,147.76 MD-3.3
PWM4
  Bottom 0.305: MD-4.3
  Bottom 0.406: 4_32_PORTD.6 162.46,152 161.7,152.76 138.42,152.76 134.91,149.25 134.92,149.24 MD-4.3
SCK
  Top 0.406: 27.53,106.54 25.47,106.54 17.03,114.98 17.03,146.69 17.73,147.39 3_32_PORTB.8 17.71,149.38 | 1_32_PORTB.8 15.95,11.99 15.95,15.61 14.48,17.08 14.48,48.6 21.73,55.85 21.73,97.76 26.34,102.37 26.34,105.35 27.53,106.54 | 27.53,106.54 2560_PORTB.2
  Bottom 0.406: 194.94,152.02 4_32_PORTB.8 196.14,150.76 196.14,142.07 191.58,137.51 63.04,137.51 59.86,140.69 22.2,140.69 17.73,145.16 3_32_PORTB.8 | 1_32_PORTB.8 17.21,10.88 18.51,12.18 18.51,19.98 23.14,24.61 90.91,24.61 95.91,29.61 95.91,37.46 99.33,40.88 124.88,40.88 127.36,38.4 127.36,27.94 129.99,25.31 191.45,25.31 201.31,15.45 2_32_PORTB.8
SS
  Top 0.406: 2560_PORTB.1 32.19,106.56 39.04,106.56 40.4,107.92 | 40.4,107.92 40.4,35.86 25.58,21.04 | 40.4,107.92 40.4,122.25 36.39,126.26 26.09,126.26 24.32,128.03 24.32,139.18 21.53,141.97 21.53,150.68 3_32_PORTB.5 20.27,153 18.82,154.45 8.81,154.45 R9.2 | 25.58,21.04 22.65,21.04 19.75,18.14 1_32_PORTB.5 | 25.58,21.04 31.12,21.04 R7.2 | 4_32_PORTB.5 192.34,148.09 190.02,145.77 178.05,145.77 R10.2
  Bottom 0.406: 192.44,149.38 4_32_PORTB.5 192.34,147.58 190.61,145.85 189.02,145.85 184.72,141.55 67.82,141.55 64.97,144.4 24.22,144.4 21.51,147.11 21.51,150.7 3_32_PORTB.5 | 2_32_PORTB.5 197.49,11.06 197.49,14.45 190,21.94 184.51,21.94 | 1_32_PORTB.5 19.75,18.69 24.04,22.98 94,22.98 97.81,26.79 97.81,36.39 100.46,39.04 122.34,39.04 124.44,36.94 124.44,25.85 128.35,21.94 184.51,21.94 | R8.2 187.5,18.95 184.51,21.94
VCC
  Top 0.305: 10.04,36.23 PS2.5 | 128.5,11.86 ENCODER2.1 | 113.71,149.65 ENCODER4.1 | LIMIT_SWITCH1.1 | 128.46,11.9 ENCODER2.1 | ENCODER2.1
  Top 0.406: 4_32_PORTB.10 197.42,153.95 196.03,155.34 180.11,155.34 178.19,153.42 R10.1 176.43,153.43 173.79,150.79 | 2_32_PORTB.10 205.84,12.32 206.9,11.26 | 206.9,11.26 206.9,7.72 206.74,7.56 204.53,5.35 | 128.52,6.97 ENCODER2.1 128.44,11.84 124.39,15.89 115.51,15.89 BRD-PISTON.9 | 176.17,21.14 176.17,27.35 | 176.17,21.14 2_32_PORTD.10 | 176.17,27.35 176.17,30.62 | 176.17,30.62 176.12,30.68 188.45,43.01 188.45,65.83 182.85,71.43 | 182.85,71.43 2560_LED.9 | 182.85,71.43 182.85,79.04 32_LED.10 | 176.17,30.62 176.06,30.62 173.18,27.74 114.82,27.74 | 2560_PORTA-BRD(PISTON).9 115.49,28.41 114.82,27.74 | 114.82,27.74 93.5,27.74 88.82,32.42 2560-PORTC(PS2).9 | 1_32_PORTB.10 12.11,13.29 12.11,34.16 10.04,36.23 | 2560_PORTL.9 32.85,65.88 32.85,65.79 33.93,64.71 | 33.93,64.71 33.93,55.02 33.94,55.01 R1.1 | 88.08,15.88 85.41,13.21 61.79,13.21 | 88.08,15.88 89.66,17.46 94.87,17.46 97,15.33 97,7.31 99.73,4.58 | ENCODER1.1 88.08,15.88 | 61.79,13.21 1_32_PORTD.10 | LIMIT_SWITCH1.1 50.21,138.49 48.38,140.32 | 101.21,144.72 87.06,144.72 82.66,140.32 48.38,140.32 | ENCODER3.1 99.74,146.19 101.21,144.72 | 111.51,144.72 101.21,144.72 | 46.76,140.32 41.78,140.32 40.54,139.08 LIMIT_SWITCH2.1 | 46.76,140.32 48.38,140.32 | 111.51,144.72 119.67,144.72 120.13,144.72 123.92,140.93 163.93,140.93 164.95,141.95 | 164.95,141.95 181.59,141.95 R5.1 | 33.93,64.71 33.93,68.82 30.73,72.02 28.03,72.02 26.22,73.83 26.22,83.8 | 26.22,83.8 26.22,94.55 27.27,95.6 LIMIT_SWITCH3.1 | LIMIT_SWITCH4.1 27.47,82.55 26.22,83.8 | 3_32_PORTD.10 45.12,141.96 46.76,140.32 | 206.9,11.26 206.9,22.52 R6.1 178.4,25.12 176.17,27.35 | ENCODER4.1 113.73,146.94 111.51,144.72
  Top 0.406: R7.1 53.94,21.06 61.79,13.21 | R8.1 178.36,18.95 176.17,21.14 | 173.79,150.79 4_32_PORTD.10 | 164.95,141.95 173.79,150.79 | 128.52,6.97 128.52,6.91 | VCC.1 6.26,136.1 3.96,138.4 | 128.52,6.97 128.49,6.97 126.1,4.58
  Top 1.016: 3_32_PORTB.10 11.38,149.4 R9.1 5.34,145.25 3.96,143.87 3.96,138.4 3.96,38.29 6.1,36.15 PS2.5 | 1_32_PORTB.10 14.69,10.71 14.69,7.46 17.57,4.58 R3.1 99.73,4.58 126.1,4.58 203.76,4.58 206.74,7.56
  Bottom 0.305: PS2.5 | BRD-PISTON.9 115.49,16.08 114.21,17.36
  Bottom 0.406: LED9.A 184.99,60.2 2560_LED.9 | PS2.5 4.92,36.15 3.73,37.34 3.73,47.5 6.09,49.86 17.29,49.86 20.76,46.39 R1.1 | 114.21,17.36 114.21,20.63 115.5,21.92 2560_PORTA-BRD(PISTON).9 | VCC.4 VCC.3 VCC.2 VCC.1 | LIMIT_SWITCH2.1 40.54,138.38 39.57,139.35 33.76,139.35 | 33.76,139.35 19.34,139.35 17.55,141.14 17.55,142.53 15.19,144.89 3_32_PORTB.10 | R4.1 31.48,137.07 33.76,139.35 | LIMIT_SWITCH3.1 33.95,95.59 35.35,96.99 35.35,115.45 34.09,116.71 2560_PORTB.9
(copper drawn outside any net)
  shapes: Top area x2

### Text on the board
tNames: T0 | T0 | GND | VCC | GND | VCC | GND | OC1A | INT1 | INT2 | GND | OC1A | INT1 | INT2 | GND | VCC | GND | PH1 | VCC | OC3A | INT1 | GND | INT2 | VCC | PH0 | GND | INT1 | GND | OC3A | INT1 | INT2 | OC3B | INT1 | GND | INT2 | GND | OC1C | INT1 | INT2 | VCC | OC3C | PE2 | INT1 | GND | GND | INT2 | OC1B | GND | VCC | INT1 | PE7 | INT2 | GND | OC4B | GND | INT1 | POWER LED | INT2 | OC1A | INT1 | INT2 | OC1A | INT2 | INT1 | OC1A | OC1A | GND | INT2 | INT1 | OC1A | GND | T0 | T0 | VCC | GND | VCC | GND